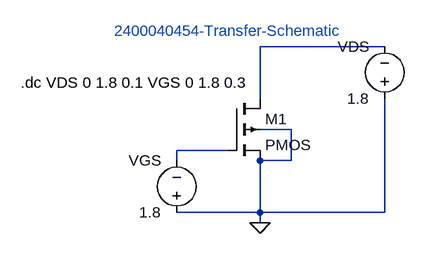
[diagram p0: schematic PMOS.asc]
PMOS.asc, the LTspice schematic file:
Version 4.1
SHEET 1 880 680
WIRE 400 32 208 32
WIRE 208 112 208 32
WIRE 256 160 208 160
WIRE 160 192 80 192
WIRE 80 208 80 192
WIRE 256 208 256 160
WIRE 256 208 208 208
WIRE 208 288 208 208
WIRE 208 288 80 288
WIRE 400 288 400 112
WIRE 400 288 208 288
WIRE 208 304 208 288
FLAG 208 304 0
SYMBOL pmos4 160 112 R0
SYMATTR InstName M1
SYMBOL voltage 80 304 R180
WINDOW 0 24 96 Left 2
WINDOW 3 24 16 Left 2
SYMATTR InstName VGS
SYMATTR Value 1.8
SYMBOL voltage 400 128 R180
WINDOW 0 24 96 Left 2
WINDOW 3 24 16 Left 2
SYMATTR InstName VDS
SYMATTR Value 1.8
TEXT -160 88 Left 2 !.dc VDS 0 1.8 0.1 VGS 0 1.8 0.3
TEXT -16 8 Left 2 ;2400040454-Transfer-Schematic

The netlist it stands for:
* PMOS.asc
M1 N001 N002 0 0 PMOS
VGS 0 N002 1.8
VDS 0 N001 1.8
.model NMOS NMOS
.model PMOS PMOS
.lib standard.mos
.dc VDS 0 1.8 0.1 VGS 0 1.8 0.3
* 2400040454-Transfer-Schematic
.backanno
.end